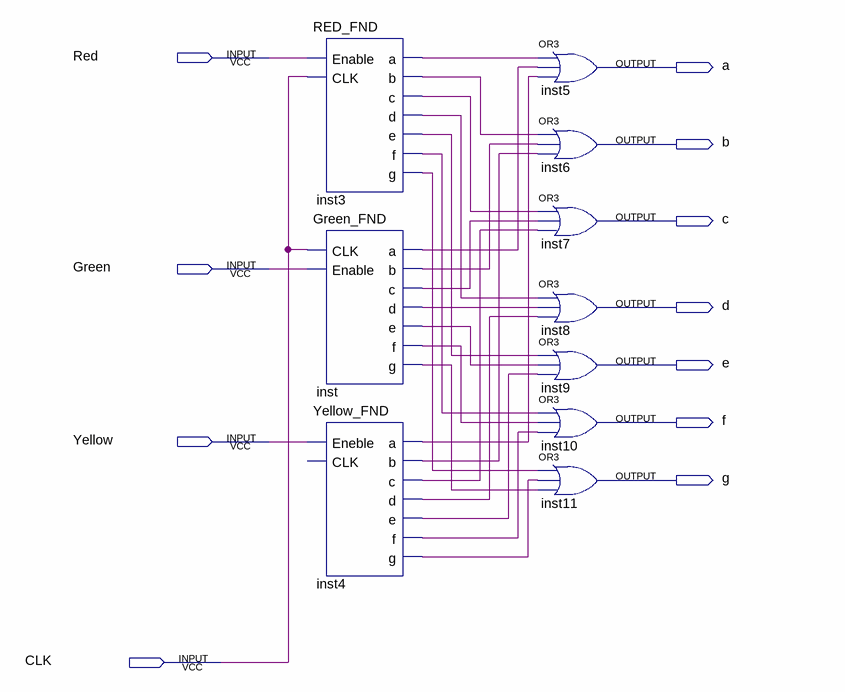
[diagram p0: schematic sheet]
// Quartus schematic FNDRGYprint.bdf as structural Verilog: 10 symbols, 11 pins
module FNDRGYprint (
  input  Red,
  input  Green,
  input  Yellow,
  input  CLK,
  output a,
  output b,
  output c,
  output d,
  output e,
  output f,
  output g
);

  wire inst3_a, inst3_b, inst3_c, inst3_d, inst3_e, inst3_f, inst3_g, inst4_a, inst4_b, inst4_c, inst4_d,
       inst4_e, inst4_f, inst4_g, inst_a, inst_b, inst_c, inst_d, inst_e, inst_f, inst_g;

  RED_FND inst3 (
    .Enable(Red), .CLK(CLK), .a(inst3_a), .b(inst3_b), .c(inst3_c), .d(inst3_d), .e(inst3_e), .f(inst3_f),
    .g(inst3_g));
  Green_FND inst (
    .CLK(CLK), .Enable(Green), .a(inst_a), .b(inst_b), .c(inst_c), .d(inst_d), .e(inst_e), .f(inst_f),
    .g(inst_g));
  Yellow_FND inst4 (
    .Eneble(Yellow), .a(inst4_a), .b(inst4_b), .c(inst4_c), .d(inst4_d), .e(inst4_e), .f(inst4_f), .g(inst4_g));  // open: CLK
  or inst5 (a, inst3_a, inst_a, inst4_a);
  or inst6 (b, inst3_b, inst_b, inst4_b);
  or inst7 (c, inst3_c, inst_c, inst4_c);
  or inst8 (d, inst3_d, inst_d, inst4_d);
  or inst9 (e, inst3_e, inst_e, inst4_e);
  or inst10 (f, inst3_f, inst_f, inst4_f);
  or inst11 (g, inst3_g, inst4_g, inst_g);
endmodule
